# EAGLE design tree (EAGLE 7.5.0)
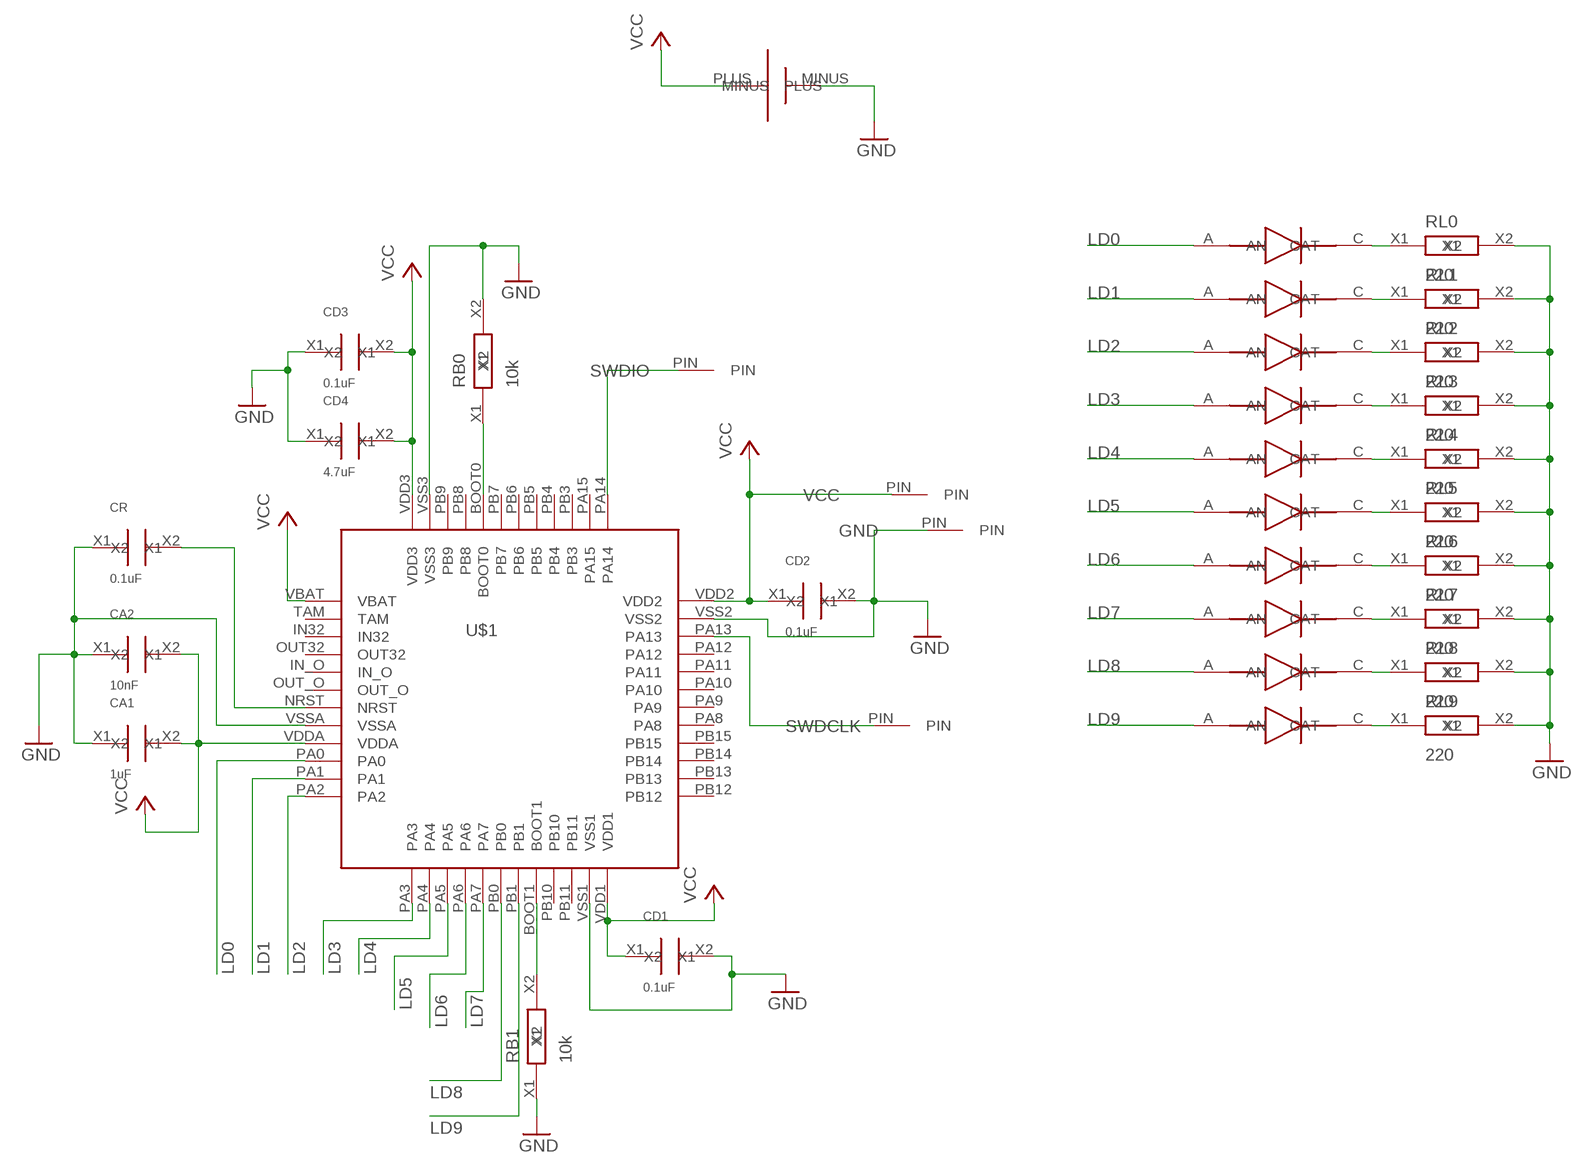
[diagram p0: schematic, sheet 1]

## Parts
CA1  1uF  C_SMD_2.1X1.25  [SMD_2.1X1.25]
CA2  10nF  C_SMD_2.1X1.25  [SMD_2.1X1.25]
CD1  0.1uF  C_SMD_2.1X1.25  [SMD_2.1X1.25]
CD2  0.1uF  C_SMD_2.1X1.25  [SMD_2.1X1.25]
CD3  0.1uF  C_SMD_2.1X1.25  [SMD_2.1X1.25]
CD4  4.7uF  C_SMD_2.1X1.25  [SMD_2.1X1.25]
CR  0.1uF  C_SMD_2.1X1.25  [SMD_2.1X1.25]
GND  PIN_06  [PIN_06]
RB0  10k  R_SMD_2.1X1.25  [SMD_2.1X1.25]
RB1  10k  R_SMD_2.1X1.25  [SMD_2.1X1.25]
RL0  220  R_SMD_2.1X1.25  [SMD_2.1X1.25]
RL1  220  R_SMD_2.1X1.25  [SMD_2.1X1.25]
RL2  220  R_SMD_2.1X1.25  [SMD_2.1X1.25]
RL3  220  R_SMD_2.1X1.25  [SMD_2.1X1.25]
RL4  220  R_SMD_2.1X1.25  [SMD_2.1X1.25]
RL5  220  R_SMD_2.1X1.25  [SMD_2.1X1.25]
RL6  220  R_SMD_2.1X1.25  [SMD_2.1X1.25]
RL7  220  R_SMD_2.1X1.25  [SMD_2.1X1.25]
RL8  220  R_SMD_2.1X1.25  [SMD_2.1X1.25]
RL9  220  R_SMD_2.1X1.25  [SMD_2.1X1.25]
SWDCLK  PIN_06  [PIN_06]
SWDIO  PIN_06  [PIN_06]
U$1  STM32F103CBT6  [STM32F103CBT6]
U$2  LED0805  [LED0805]
U$3  LED0805  [LED0805]
U$4  LED0805  [LED0805]
U$5  LED0805  [LED0805]
U$6  LED0805  [LED0805]
U$7  LED0805  [LED0805]
U$8  LED0805  [LED0805]
U$9  LED0805  [LED0805]
U$10  LED0805  [LED0805]
U$11  LED0805  [LED0805]
U$12  VBAT  [VBAT]
VCC  PIN_06  [PIN_06]

## Nets
GND: CA1.X1 CA2.X1 CD1.X2 CD2.X2 CD3.X1 CD4.X1 CR.X1 GND.PIN RB0.X2 RB1.X1 RL0.X2 RL1.X2 RL2.X2 RL3.X2 RL4.X2 RL5.X2 RL6.X2 RL7.X2 RL8.X2 RL9.X2 U$1.VSS1 U$1.VSS2 U$1.VSS3 U$1.VSSA U$12.MINUS
LD0: U$1.PA0 U$4.A(AN)
LD1: U$1.PA1 U$2.A(AN)
LD2: U$1.PA2 U$3.A(AN)
LD3: U$1.PA3 U$5.A(AN)
LD4: U$1.PA4 U$6.A(AN)
LD5: U$1.PA5 U$7.A(AN)
LD6: U$1.PA6 U$8.A(AN)
LD7: U$1.PA7 U$9.A(AN)
LD8: U$1.PB0 U$10.A(AN)
LD9: U$1.PB1 U$11.A(AN)
N$1: RB1.X2 U$1.BOOT1
N$3: CR.X2 U$1.NRST
N$6: RB0.X1 U$1.BOOT0
N$7: RL0.X1 U$4.C(CAT)
N$8: RL1.X1 U$2.C(CAT)
N$9: RL2.X1 U$3.C(CAT)
N$11: RL3.X1 U$5.C(CAT)
N$12: RL4.X1 U$6.C(CAT)
N$13: RL5.X1 U$7.C(CAT)
N$14: RL6.X1 U$8.C(CAT)
N$15: RL7.X1 U$9.C(CAT)
N$16: RL8.X1 U$10.C(CAT)
N$17: RL9.X1 U$11.C(CAT)
SWDCLK: SWDCLK.PIN U$1.PA13
SWDIO: SWDIO.PIN U$1.PA14
VCC: CA1.X2 CA2.X2 CD1.X1 CD2.X1 CD3.X2 CD4.X2 U$1.VBAT U$1.VDD1 U$1.VDD2 U$1.VDD3 U$1.VDDA U$12.PLUS VCC.PIN
Unconnected: U$1.IN32 U$1.IN_O U$1.OUT32 U$1.OUT_O U$1.PA8 U$1.PA9 U$1.PA10 U$1.PA11 U$1.PA12 U$1.PA15 U$1.PB3 U$1.PB4 U$1.PB5 U$1.PB6 U$1.PB7 U$1.PB8 U$1.PB9 U$1.PB10 U$1.PB11 U$1.PB12 U$1.PB13 U$1.PB14 U$1.PB15 U$1.TAM

## Library data of the parts
CA1 CA2 CD1-CD4 CR = MyPowerComponents:C_SMD_2.1X1.25
GND SWDCLK SWDIO VCC = My_STM32:PIN_06
RB0 RB1 RL0 RL1-RL9 = MyPowerComponents:R_SMD_2.1X1.25
U$1 = My_STM32:STM32F103CBT6
U$2-U$11 = My_FTDI:LED0805
U$12 = My_STM32:VBAT

## Board
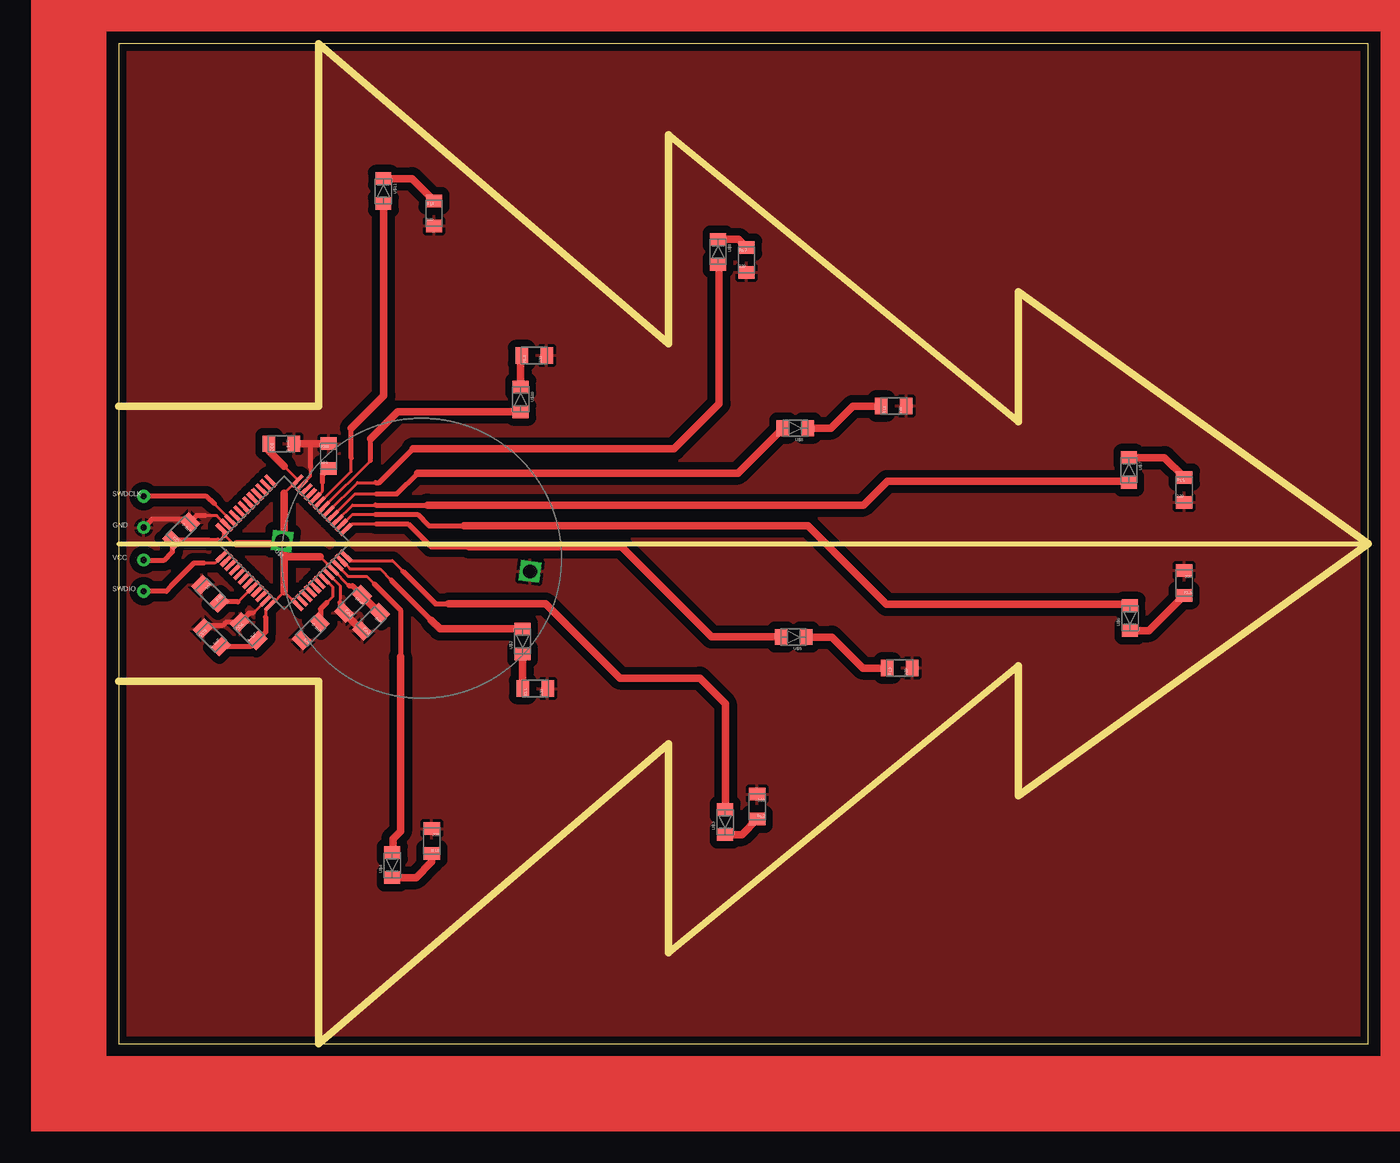
[diagram p1: board, top side]
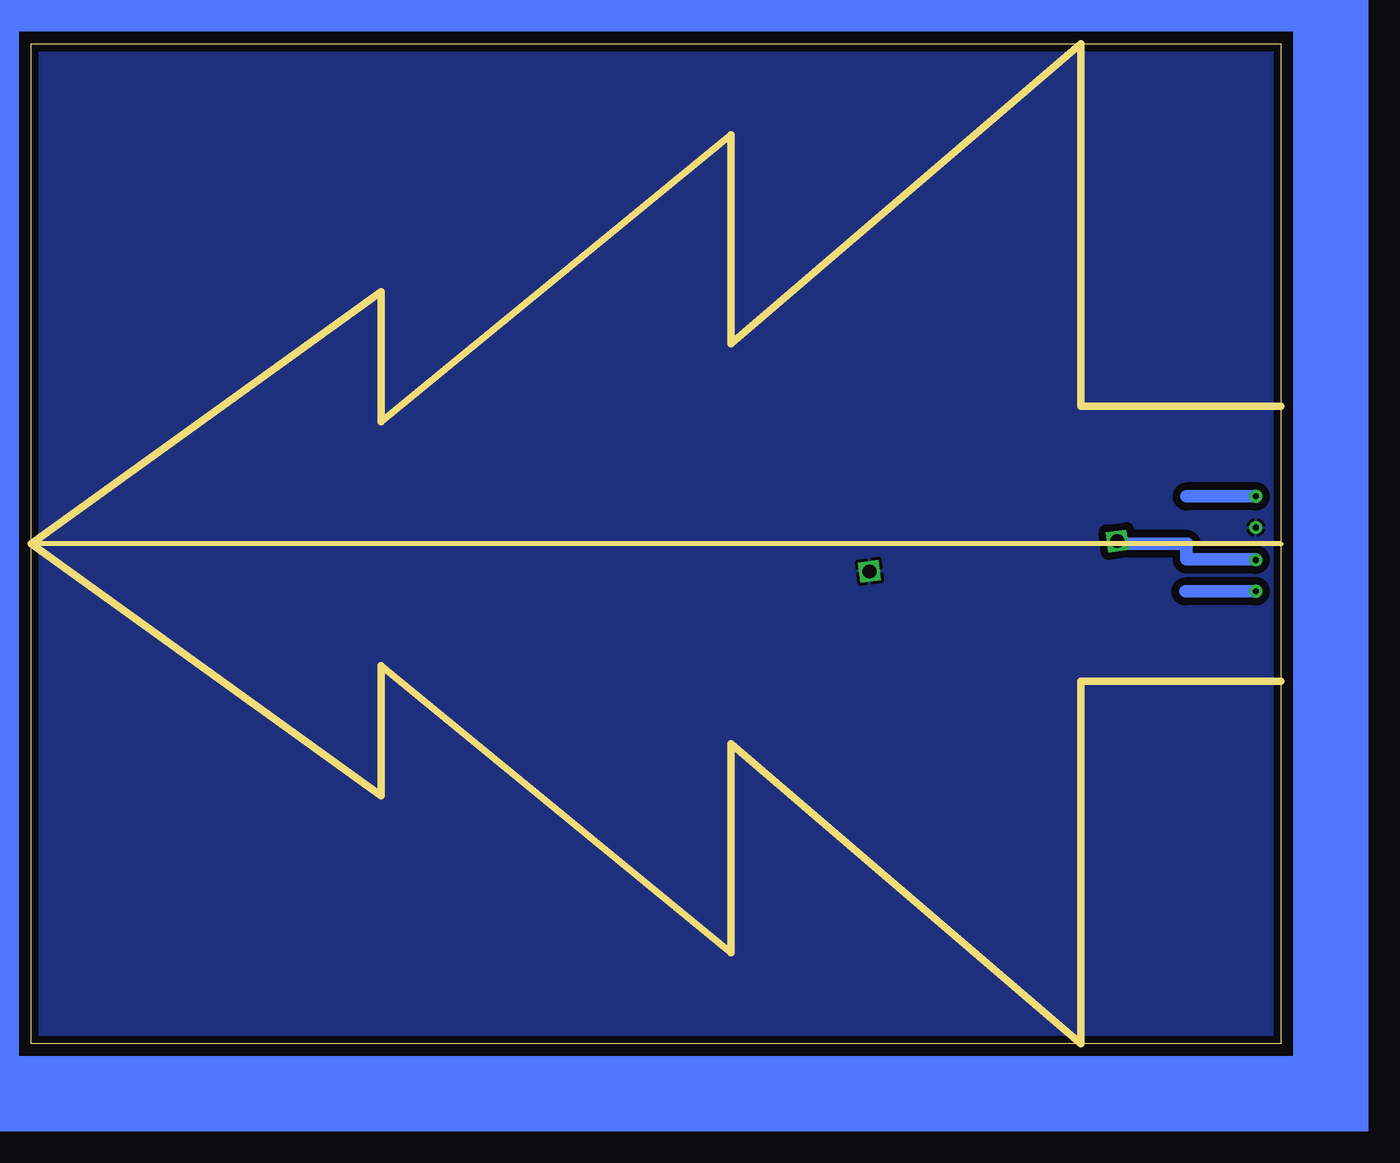
[diagram p2: board, bottom side, seen from below]

Size 100 x 80 mm. Coordinates in mm from the lower left corner, seen from the top.
Outline: 0,0 100,0 100,80 0,80 0,0
Copper layers (1*16): Top 0.035mm / dielectric 1.5mm / Bottom 0.035mm
Design rules "default *": minimum track width 10mil, minimum drill 24mil, track to track 8mil, track to pad 8mil, pad to pad 8mil, via to via 8mil, smd to smd 8mil, copper to edge 1mil, drill to drill 1mil, minimum pad ring 10mil, minimum via ring 8mil, stop-mask expansion 4mil, vias tented up to drill 0mil, thermal gap 10mil
Milling: 15 lines

### Footprints (pad centres in the part's own frame; a part is rotated, then mirrored left to right if it is on the bottom)
SMD_2.1X1.25 = smd 1.3 x 1: X1 0,1; X2 0,-1
PIN_06 = drill 0.5: PIN 0,0
STM32F103CBT6 = smd 0.3 x 1.2: BOOT0 -0.75,4.25; BOOT1 0.75,-4.25; PA3 -2.75,-4.25; PA4 -2.25,-4.25; PA5 -1.75,-4.25; PA6 -1.25,-4.25; PA7 -0.75,-4.25; PA14 2.75,4.25; PA15 2.25,4.25; PB0 -0.25,-4.25; PB1 0.25,-4.25; PB3 1.75,4.25; PB4 1.25,4.25; PB5 0.75,4.25; PB6 0.25,4.25; PB7 -0.25,4.25; PB8 -1.25,4.25; PB9 -1.75,4.25; PB10 1.25,-4.25; PB11 1.75,-4.25; VDD1 2.75,-4.25; VDD3 -2.75,4.25; VSS1 2.25,-4.25; VSS3 -2.25,4.25 | smd 1.2 x 0.3: IN32 -4.25,1.75; IN_O -4.25,0.75; NRST -4.25,-0.25; OUT32 -4.25,1.25; OUT_O -4.25,0.25; PA0 -4.25,-1.75; PA1 -4.25,-2.25; PA2 -4.25,-2.75; PA8 4.25,-0.75; PA9 4.25,-0.25; PA10 4.25,0.25; PA11 4.25,0.75; PA12 4.25,1.25; PA13 4.25,1.75; PB12 4.25,-2.75; PB13 4.25,-2.25; PB14 4.25,-1.75; PB15 4.25,-1.25; TAM -4.25,2.25; VBAT -4.25,2.75; VDD2 4.25,2.75; VDDA -4.25,-1.25; VSS2 4.25,2.25; VSSA -4.25,-0.75
LED0805 = smd 1.27 x 1: A 0,1; C 0,-1
VBAT = drill 1.1 square: MINUS 10,0; PLUS -10,0

### Placement (x,y rotation side)
CA1  20.19,33.75 135 top
CA2  18.75,35.2 135 top
CD1  13.03,48.01 90 top
CD2  4.99,41.01 135 top
CD3  7.45,32.51 45 top
CD4  10.41,33.01 45 top
CR  15.37,33.01 135 top
GND  2,41.3 0 top
RB0  7.33,36.01 225 top
RB1  16.79,47.01 0 top
RL0  25.05,16.21 180 top
RL1  33.33,28.42 90 top
RL2  51.09,18.97 180 top
RL3  62.5,30.07 90 top
RL4  85.26,36.87 180 top
RL5  85.27,44.32 0 top
RL6  62.03,51.02 90 top
RL7  50.24,62.72 0 top
RL8  33.25,55.07 90 top
RL9  25.23,66.43 0 top
SWDCLK  2,43.8 0 top
SWDIO  2,36.2 0 top
U$1  13.22,40.08 135 top
U$2  32.32,32.19 0 top
U$3  48.53,17.74 0 top
U$4  21.89,14.29 0 top
U$5  54,32.54 90 top
U$6  80.93,34.05 0 top
U$7  80.84,45.9 180 top
U$8  54.15,49.25 90 top
U$9  47.96,63.35 180 top
U$10  32.17,51.55 180 top
U$11  21.18,68.2 180 top
U$12  23,39 353 top
VCC  2,38.7 0 top

### Tracks (layer width: path | path; a pad name or v marks a point on that pad's centre or on a via)
GND
  Top 0.254: U$1.VSS3 11.78,35.48 10.75,34.45 | U$1.VSSA 16.76,37.59 17.7,36.65 17.7,35.3 | U$1.VSS2 8.61,41.49 7.85,42.25 6.95,42.25 | U$1.VSS1 15.35,45.4 15.35,46.15
  Top 0.406: 10.75,34.45 10.44,34.45 CD4.X1 8.57,33.72 8.3,33.45 6.98,33.45 CD3.X1 | 17.7,35.3 17.7,34.84 CA2.X1 | 6.95,42.25 6.23,42.25 CD2.X2 5.41,42 2.7,42 GND.PIN | 15.35,46.15 15.35,47.9 15.25,48 CD1.X2
  Top 0.61: CA2.X1 CA1.X1 | CD1.X2 RB1.X1
  pour Top (isolate 0.61): 0,0 100,0 100,80 0,80
  pour Bottom (isolate 0.61): 0,0 100,0 100,80 0,80
LD0
  Top 0.254: U$1.PA0 17.46,38.29 18.35,37.4 19.85,37.4 20.45,36.8
  Top 0.406: 20.45,36.8 22.55,34.7 22.55,30.95
  Top 0.61: 22.55,30.95 22.55,17 21.95,16.4 21.95,15.35 U$4.A
LD1
  Top 0.254: U$1.PA1 17.83,38.67 18.5,38 20.9,38 21.8,37.1
  Top 0.406: 21.8,37.1 25,33.9
  Top 0.61: 25,33.9 25.7,33.2 U$2.A
LD2
  Top 0.254: U$1.PA2 18.18,39.02 18.55,38.65 21.9,38.65 22.75,37.8
  Top 0.406: 22.75,37.8 25.35,35.2 26.4,35.2
  Top 0.61: 26.4,35.2 34.15,35.2 40.1,29.25 46.5,29.25 48.55,27.2 48.55,18.76 U$3.A
LD3
  Top 0.254: U$1.PA3 18.19,41.14 18.65,41.6 20.6,41.6
  Top 0.406: 20.6,41.6 23.15,41.6 25,39.75 28.05,39.75
  Top 0.61: 28.05,39.75 40.25,39.75 47.45,32.55 U$5.A
LD4
  Top 0.254: U$1.PA4 17.84,41.49 18.7,42.35 20.55,42.35
  Top 0.406: 20.55,42.35 23.9,42.35 24.8,41.45 27.65,41.45
  Top 0.61: 27.65,41.45 55.15,41.45 61.45,35.15 80.83,35.15 U$6.A
LD5
  Top 0.254: U$1.PA5 17.46,41.86 18.7,43.1 20.55,43.1
  Top 0.406: 20.55,43.1 24.7,43.1
  Top 0.61: 24.7,43.1 59.6,43.1 61.5,45 80.74,45 U$7.A
LD6
  Top 0.254: U$1.PA6 18.9,44 20.6,44
  Top 0.406: 20.6,44 22.25,44 23.9,45.65
  Top 0.61: 23.9,45.65 49.55,45.65 U$8.A 53.05,49.35
LD7
  Top 0.254: U$1.PA7 16.8,42.55 16.8,42.6 19.1,44.9 20.55,44.9
  Top 0.406: 20.55,44.9 20.85,44.9 23.55,47.6
  Top 0.61: 23.55,47.6 44.45,47.6 48.05,51.2 48.05,62.26 U$9.A
LD8
  Top 0.254: U$1.PB0 20.15,46.65
  Top 0.406: 20.15,46.65 20.15,48.4
  Top 0.61: 20.15,48.4 22.3,50.55 U$10.A
LD9
  Top 0.254: U$1.PB1 16.06,43.26 18.6,45.8 18.6,46.85
  Top 0.406: 18.6,46.85 18.6,49.25
  Top 0.61: 18.6,49.25 21.2,51.85 21.2,67.18 U$11.A
N$1
  Top 0.254: U$1.BOOT1 15.72,43.62 16.3,44.2 16.3,44.9
  Top 0.406: 16.3,44.9 16.3,45.52 RB1.X2
N$3
  Top 0.254: U$1.NRST 17.1,36.55 17.1,35.75 16.65,35.3
  Top 0.406: 16.65,35.3 16.15,34.8 16.15,33.79 CR.X2
N$6
  Top 0.254: U$1.BOOT0 9.55,35.35
  Top 0.406: 9.55,35.35 8.08,35.35 RB0.X1
N$7
  Top 0.61: U$4.C 23.79,13.29 25.05,14.55 RL0.X1
N$8
  Top 0.61: RL1.X1 U$2.C
N$9
  Top 0.61: U$3.C 49.86,16.74 RL2.X1
N$11
  Top 0.61: U$5.C 57.06,32.54 59.55,30.05 61.48,30.05 RL3.X1
N$12
  Top 0.61: U$6.C 82.44,33.05 RL4.X1
N$13
  Top 0.61: U$7.C 83.69,46.9 RL5.X1
N$14
  Top 0.61: U$8.C 57,49.25 58.75,51 61.01,51 RL6.X1
N$15
  Top 0.61: U$9.C 49.61,64.35 RL7.X1
N$16
  Top 0.61: U$10.C 32.17,54.99 RL8.X1
N$17
  Top 0.61: U$11.C 23.46,69.2 RL9.X1
SWDCLK
  Top 0.254: U$1.PA13 8.98,41.87 7.65,43.2
  Top 0.406: 7.65,43.2 7,43.8 SWDCLK.PIN
  Bottom 1.016: SWDCLK.PIN 7.55,43.8
SWDIO
  Top 0.254: U$1.PA14 7.7,38.45 6.8,38.45
  Top 0.406: 6.8,38.45 6,38.45 4.15,36.6 3.8,36.2 SWDIO.PIN
  Bottom 1.016: SWDIO.PIN 7.65,36.2
VCC  (1 unrouted)
  Top 0.254: 11.75,34.15 11.75,34.7 12.16,35.11 U$1.VDD3 12.23,35.13 13.25,36.15 U$1.VBAT | U$1.VDDA 17.11,37.94 | 17.11,37.94 18.4,36.65 | U$1.VDD1 14.28,45.17 | 7.95,40.3 8.1,40.3 8.4,40.6 | 8.4,40.6 8.4,41.01 U$1.VDD2 | 13.25,46.2 14.28,45.17 | 14.28,45.17 14.35,45.1 14.3,45.1 13.25,44.05 | 17.11,37.94 16.1,38.95 | 8.4,40.6 8.55,40.6 9.15,40 9.45,40
  Top 0.406: 11.75,34.15 11.75,32.9 11.71,32.9 CD4.X2 10.62,31.8 CD3.X2 | 18.4,36.65 18.71,36.65 CA2.X2 | 7.95,40.3 7.2,40.3 CD2.X1 4.3,40.29 4.3,39.35 4.29,39.35 3.59,38.64 2.06,38.64 VCC.PIN
  Top 0.61: CA2.X2 19.46,35.9 CA1.X2 | CD1.X1 12.03,47.42 13.25,46.2 | 13.25,44.05 13.25,39.95 | 13.25,39.95 13.25,39.25 | 13.25,39.25 13.25,36.15 | 16.1,38.95 13.55,38.95 13.25,39.25 | 9.45,40 13.2,40 13.25,39.95
  Bottom 1.016: 7.55,40 13,40 | 7.5,40 7.55,40 | 7.55,40 7.55,38.75 2,38.75 VCC.PIN
(copper drawn outside any net)
  shapes: Bottom area x4, Top area x5